# Altium schematic sheet Transistor Output.SchDoc
size 381 x 241 mm; SheetNumber: 8; SheetTotal: 9
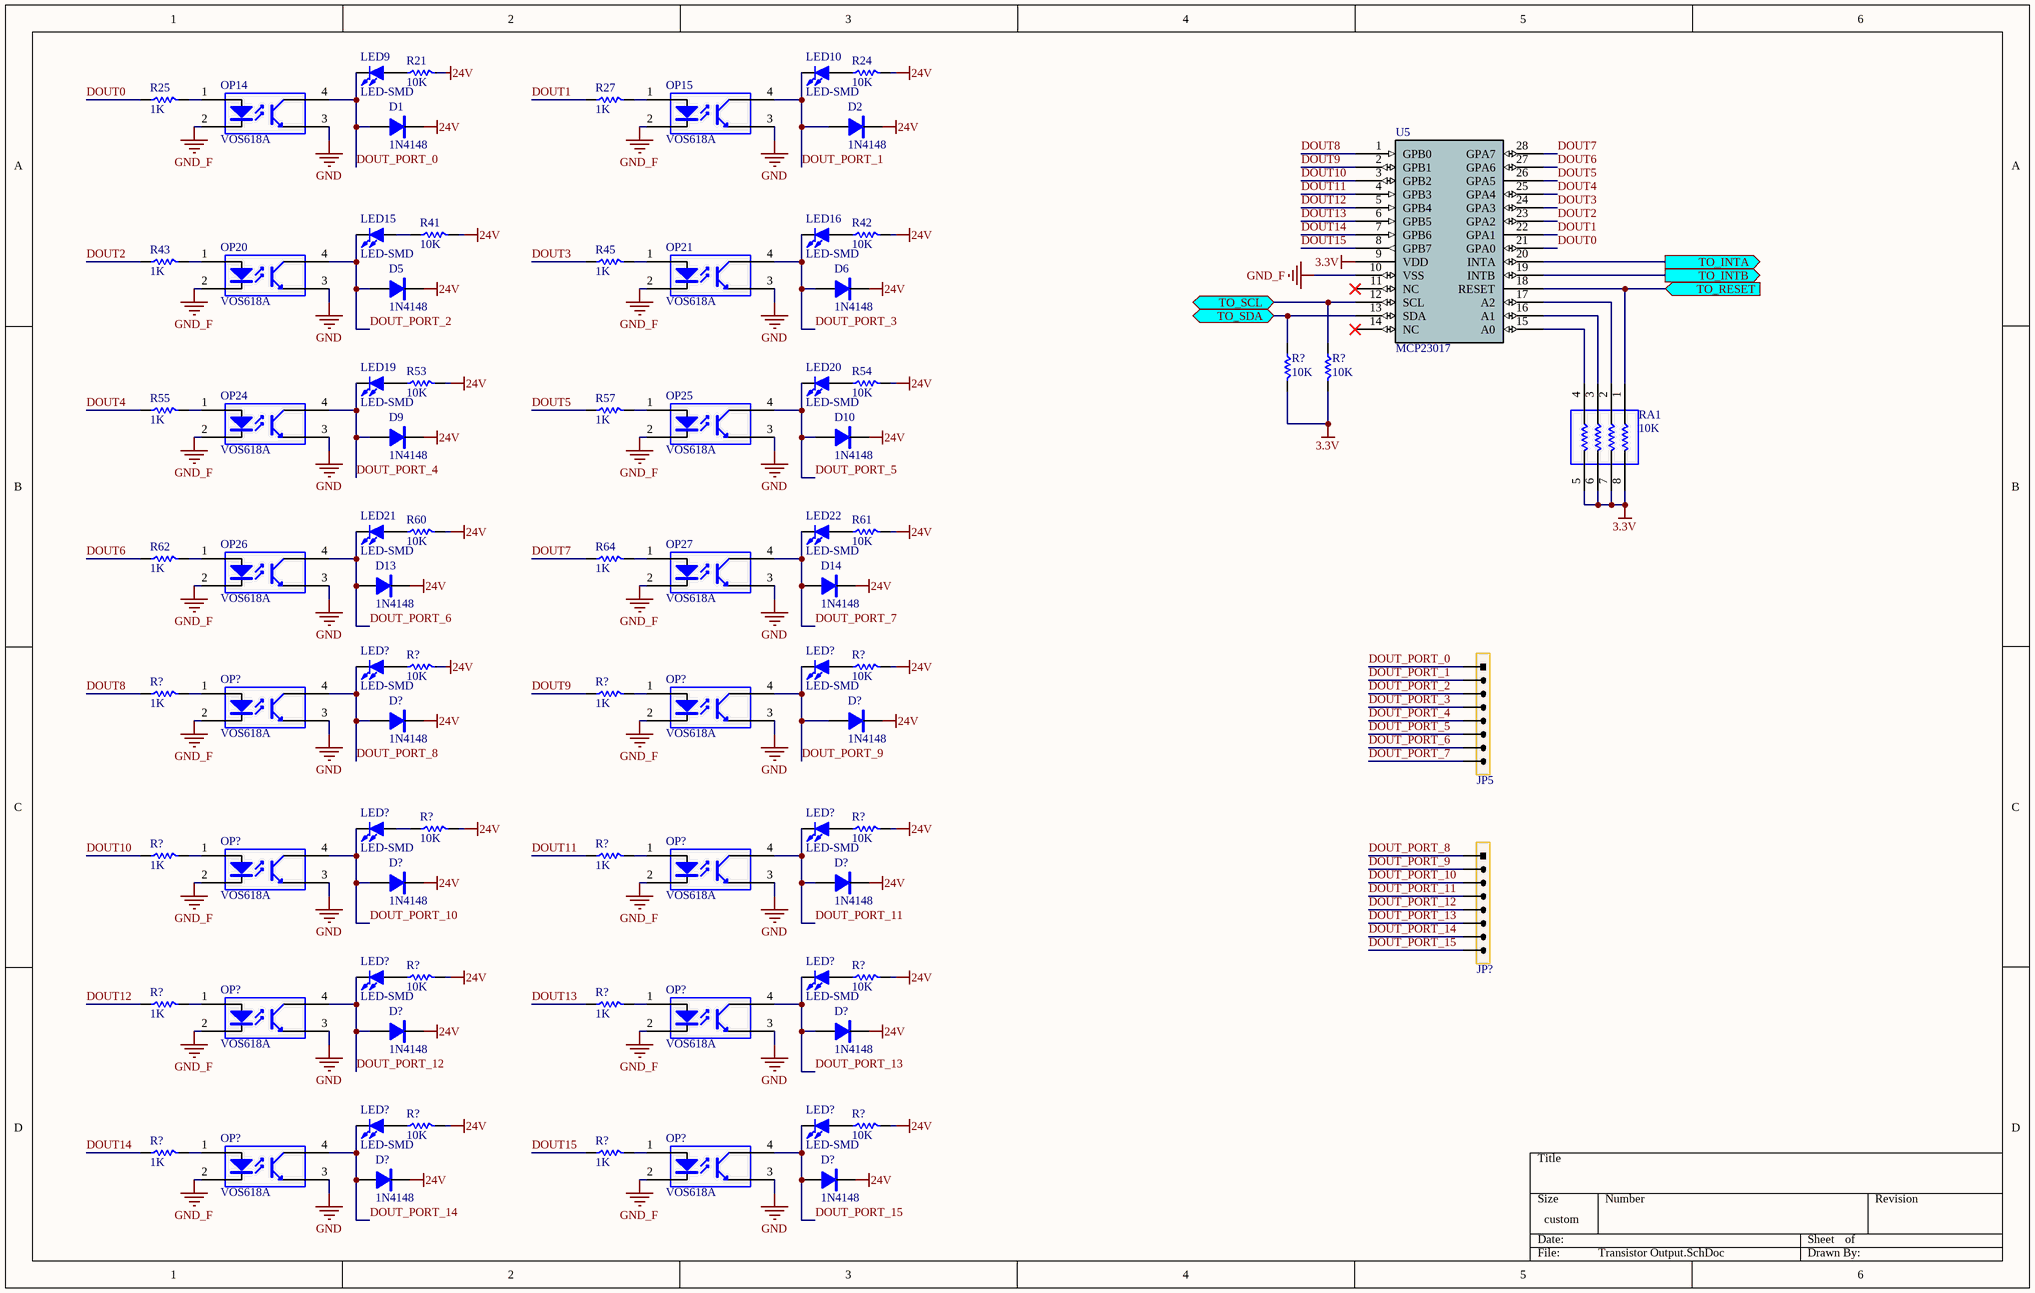
[diagram p0: Transistor Output.SchDoc]

## Parts
(Parts that share a designator on the sheet are numbered #1, #2 ... from top to bottom, then left to right.)
D1  1N4148  [SOD-323]
D2  1N4148  [SOD-323]
D5  1N4148  [SOD-323]
D6  1N4148  [SOD-323]
D9  1N4148  [SOD-323]
D10  1N4148  [SOD-323]
D13  1N4148  [SOD-323]
D14  1N4148  [SOD-323]
D?#1  1N4148  [SOD-323]
D?#2  1N4148  [SOD-323]
D?#3  1N4148  [SOD-323]
D?#4  1N4148  [SOD-323]
D?#5  1N4148  [SOD-323]
D?#6  1N4148  [SOD-323]
D?#7  1N4148  [SOD-323]
D?#8  1N4148  [SOD-323]
JP5  HDR-1X8  [KF-8P-BLK-H-3.81]  (value not drawn)
JP?  HDR-1X8  [KF-8P-BLK-H-3.81]  (value not drawn)
LED9  LED-SMD  [LED 0603B]
LED10  LED-SMD  [LED 0603B]
LED15  LED-SMD  [LED 0603B]
LED16  LED-SMD  [LED 0603B]
LED19  LED-SMD  [LED 0603B]
LED20  LED-SMD  [LED 0603B]
LED21  LED-SMD  [LED 0603B]
LED22  LED-SMD  [LED 0603B]
LED?#1  LED-SMD  [LED 0603B]
LED?#2  LED-SMD  [LED 0603B]
LED?#3  LED-SMD  [LED 0603B]
LED?#4  LED-SMD  [LED 0603B]
LED?#5  LED-SMD  [LED 0603B]
LED?#6  LED-SMD  [LED 0603B]
LED?#7  LED-SMD  [LED 0603B]
LED?#8  LED-SMD  [LED 0603B]
OP14  VOS618A  [VOS618A-SSOP4]
OP15  VOS618A  [VOS618A-SSOP4]
OP20  VOS618A  [VOS618A-SSOP4]
OP21  VOS618A  [VOS618A-SSOP4]
OP24  VOS618A  [VOS618A-SSOP4]
OP25  VOS618A  [VOS618A-SSOP4]
OP26  VOS618A  [VOS618A-SSOP4]
OP27  VOS618A  [VOS618A-SSOP4]
OP?#1  VOS618A  [VOS618A-SSOP4]
OP?#2  VOS618A  [VOS618A-SSOP4]
OP?#3  VOS618A  [VOS618A-SSOP4]
OP?#4  VOS618A  [VOS618A-SSOP4]
OP?#5  VOS618A  [VOS618A-SSOP4]
OP?#6  VOS618A  [VOS618A-SSOP4]
OP?#7  VOS618A  [VOS618A-SSOP4]
OP?#8  VOS618A  [VOS618A-SSOP4]
R21  10K  [R 0603]
R24  10K  [R 0603]
R25  1K  [R 0603]
R27  1K  [R 0603]
R41  10K  [R 0603]
R42  10K  [R 0603]
R43  1K  [R 0603]
R45  1K  [R 0603]
R53  10K  [R 0603]
R54  10K  [R 0603]
R55  1K  [R 0603]
R57  1K  [R 0603]
R60  10K  [R 0603]
R61  10K  [R 0603]
R62  1K  [R 0603]
R64  1K  [R 0603]
R?#1  10K  [R 0805]
R?#2  10K  [R 0805]
R?#3  10K  [R 0603]
R?#4  10K  [R 0603]
R?#5  1K  [R 0603]
R?#6  1K  [R 0603]
R?#7  10K  [R 0603]
R?#8  10K  [R 0603]
R?#9  1K  [R 0603]
R?#10  1K  [R 0603]
R?#11  10K  [R 0603]
R?#12  10K  [R 0603]
R?#13  1K  [R 0603]
R?#14  1K  [R 0603]
R?#15  10K  [R 0603]
R?#16  10K  [R 0603]
R?#17  1K  [R 0603]
R?#18  1K  [R 0603]
RA1  10K  [RA1206 (4x0603)]
U5  MCP23017  [SOIC28]

## Ports
TO_INTA (out), TO_INTB (out), TO_RESET (in), TO_SCL (bidir), TO_SDA (bidir)

## Nets
3.3V: R?#1.2 R?#2.2 RA1.5 RA1.6 RA1.7 RA1.8 U5.9(VDD)
24V: D1.2(K) D2.2(K) D5.2(K) D6.2(K) D9.2(K) D10.2(K) D13.2(K) D14.2(K) D?#1.2(K) D?#2.2(K) D?#3.2(K) D?#4.2(K) D?#5.2(K) D?#6.2(K) D?#7.2(K) D?#8.2(K) R21.2 R24.2 R41.2 R42.2 R53.2 R54.2 R60.2 R61.2 R?#3.2 R?#4.2 R?#7.2 R?#8.2 R?#11.2 R?#12.2 R?#15.2 R?#16.2
GND: OP14.3(E) OP15.3(E) OP20.3(E) OP21.3(E) OP24.3(E) OP25.3(E) OP26.3(E) OP27.3(E) OP?#1.3(E) OP?#2.3(E) OP?#3.3(E) OP?#4.3(E) OP?#5.3(E) OP?#6.3(E) OP?#7.3(E) OP?#8.3(E)
GND_F: OP14.2(K) OP15.2(K) OP20.2(K) OP21.2(K) OP24.2(K) OP25.2(K) OP26.2(K) OP27.2(K) OP?#1.2(K) OP?#2.2(K) OP?#3.2(K) OP?#4.2(K) OP?#5.2(K) OP?#6.2(K) OP?#7.2(K) OP?#8.2(K) U5.10(VSS)
DOUT0: R25.1 U5.21(GPA0)
DOUT1: R27.1 U5.22(GPA1)
DOUT2: R43.1 U5.23(GPA2)
DOUT3: R45.1 U5.24(GPA3)
DOUT4: R55.1 U5.25(GPA4)
DOUT5: R57.1 U5.26(GPA5)
DOUT6: R62.1 U5.27(GPA6)
DOUT7: R64.1 U5.28(GPA7)
DOUT8: R?#5.1 U5.1(GPB0)
DOUT9: R?#6.1 U5.2(GPB1)
DOUT10: R?#9.1 U5.3(GPB2)
DOUT11: R?#10.1 U5.4(GPB3)
DOUT12: R?#13.1 U5.5(GPB4)
DOUT13: R?#14.1 U5.6(GPB5)
DOUT14: R?#17.1 U5.7(GPB6)
DOUT15: R?#18.1 U5.8(GPB7)
DOUT_PORT_0: D1.1(A) JP5.1 LED9.2(K) OP14.4(C)
DOUT_PORT_1: D2.1(A) JP5.2 LED10.2(K) OP15.4(C)
DOUT_PORT_2: D5.1(A) JP5.3 LED15.2(K) OP20.4(C)
DOUT_PORT_3: D6.1(A) JP5.4 LED16.2(K) OP21.4(C)
DOUT_PORT_4: D9.1(A) JP5.5 LED19.2(K) OP24.4(C)
DOUT_PORT_5: D10.1(A) JP5.6 LED20.2(K) OP25.4(C)
DOUT_PORT_6: D13.1(A) JP5.7 LED21.2(K) OP26.4(C)
DOUT_PORT_7: D14.1(A) JP5.8 LED22.2(K) OP27.4(C)
DOUT_PORT_8: D?#1.1(A) JP?.1 LED?#1.2(K) OP?#1.4(C)
DOUT_PORT_9: D?#2.1(A) JP?.2 LED?#2.2(K) OP?#2.4(C)
DOUT_PORT_10: D?#3.1(A) JP?.3 LED?#3.2(K) OP?#3.4(C)
DOUT_PORT_11: D?#4.1(A) JP?.4 LED?#4.2(K) OP?#4.4(C)
DOUT_PORT_12: D?#5.1(A) JP?.5 LED?#5.2(K) OP?#5.4(C)
DOUT_PORT_13: D?#6.1(A) JP?.6 LED?#6.2(K) OP?#6.4(C)
DOUT_PORT_14: D?#7.1(A) JP?.7 LED?#7.2(K) OP?#7.4(C)
DOUT_PORT_15: D?#8.1(A) JP?.8 LED?#8.2(K) OP?#8.4(C)
TO_INTA: U5.20(INTA) ; port TO_INTA
TO_INTB: U5.19(INTB) ; port TO_INTB
TO_RESET: RA1.1 U5.18(RESET) ; port TO_RESET
TO_SCL: R?#2.1 U5.12(SCL) ; port TO_SCL
TO_SDA: R?#1.1 U5.13(SDA) ; port TO_SDA
NetLED9_1: LED9.1(A) R21.1
NetLED10_1: LED10.1(A) R24.1
NetLED15_1: LED15.1(A) R41.1
NetLED16_1: LED16.1(A) R42.1
NetLED19_1: LED19.1(A) R53.1
NetLED20_1: LED20.1(A) R54.1
NetLED21_1: LED21.1(A) R60.1
NetLED22_1: LED22.1(A) R61.1
NetLED?#1_1: LED?#1.1(A) R?#3.1
NetLED?#2_1: LED?#2.1(A) R?#4.1
NetLED?#3_1: LED?#3.1(A) R?#7.1
NetLED?#4_1: LED?#4.1(A) R?#8.1
NetLED?#5_1: LED?#5.1(A) R?#11.1
NetLED?#6_1: LED?#6.1(A) R?#12.1
NetLED?#7_1: LED?#7.1(A) R?#15.1
NetLED?#8_1: LED?#8.1(A) R?#16.1
NetOP14_1: OP14.1(A) R25.2
NetOP15_1: OP15.1(A) R27.2
NetOP20_1: OP20.1(A) R43.2
NetOP21_1: OP21.1(A) R45.2
NetOP24_1: OP24.1(A) R55.2
NetOP25_1: OP25.1(A) R57.2
NetOP26_1: OP26.1(A) R62.2
NetOP27_1: OP27.1(A) R64.2
NetOP?#1_1: OP?#1.1(A) R?#5.2
NetOP?#2_1: OP?#2.1(A) R?#6.2
NetOP?#3_1: OP?#3.1(A) R?#9.2
NetOP?#4_1: OP?#4.1(A) R?#10.2
NetOP?#5_1: OP?#5.1(A) R?#13.2
NetOP?#6_1: OP?#6.1(A) R?#14.2
NetOP?#7_1: OP?#7.1(A) R?#17.2
NetOP?#8_1: OP?#8.1(A) R?#18.2
NetRA1_2: RA1.2 U5.17(A2)
NetRA1_3: RA1.3 U5.16(A1)
NetRA1_4: RA1.4 U5.15(A0)

Not connected (* = marked no-connect by the designer): U5 11(NC)* 14(NC)*

## Library data of the parts
D1 D2 D5 D6 D9 D10 D13 D14 D?#1-D?#8 = 1N4148: High speed switching diode; BOM名称: 高速开关二极管; 版权归属: 源创客; 学习资源: www.ooocke.com
JP5 JP? = Header 8: 8P Connector; BOM名称: 8P接插件; 版权归属: 源创客; 学习资源: www.ooocke.com
LED9 LED10 LED15 LED16 LED19-LED22 LED?#1-LED?#8 = LED-SMD: Patch LED; BOM名称: 贴片LED; 版权归属: 源创客; 学习资源: www.ooocke.com
R21 R24 R25 R27 R41-R43 R45 R53-R55 R57 R60-R62 R64 R?#1-R?#18 = R: Chip resistor; 版权归属: 源创客; BOM名称: Chip resistor; 学习资源: www.ooocke.com
RA1 = R-ARR: 4 way Chip Resistor Array